# EAGLE schematic Lock (EAGLE 8.4.1)
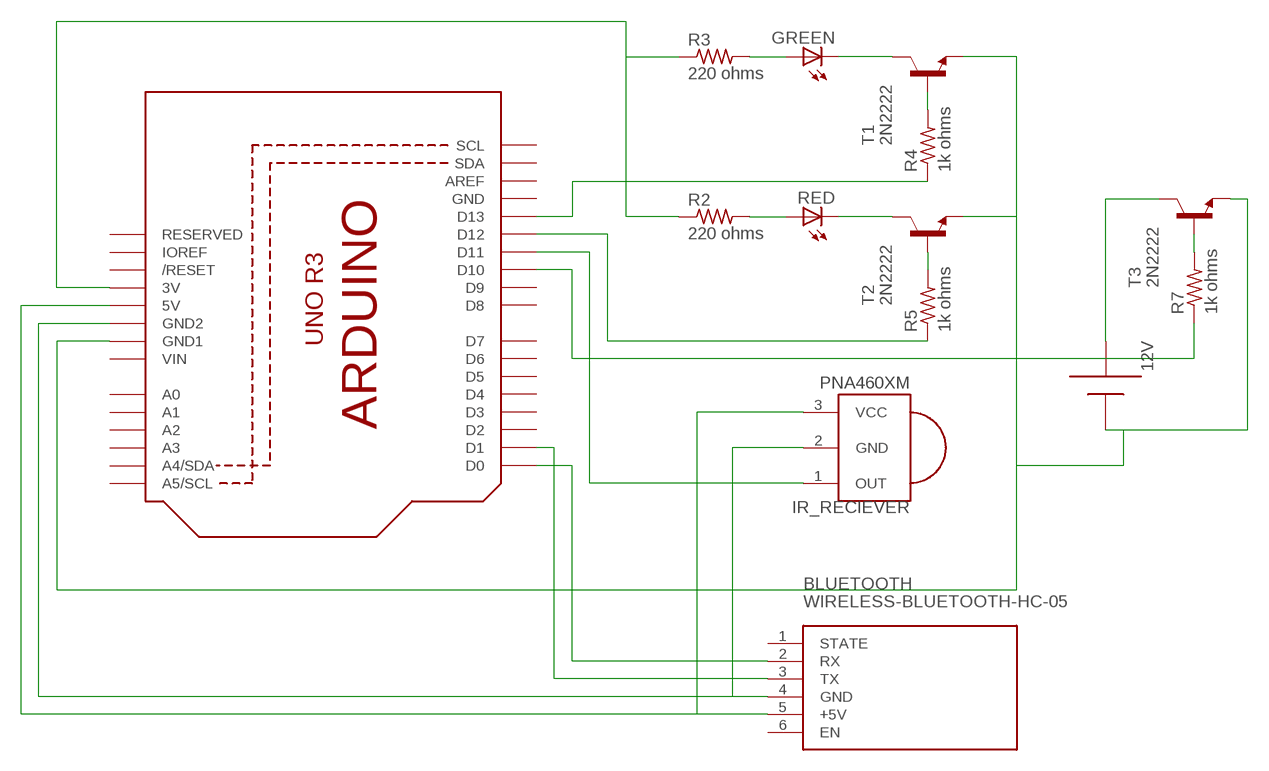
[diagram p0: schematic, sheet 1]

## Parts
12V  AAA  [12BH412]
BLUETOOTH  WIRELESS-BLUETOOTH-HC-05  [WIRELESS-BLUETOOTH-HC-05]
GREEN  LED3MM  [LED3MM]
IR_RECIEVER  PNA460XM  [PNA460XM]
R2  220 ohms  R-US_R1005  [R1005]
R3  220 ohms  R-US_R1005  [R1005]
R4  1k ohms  R-US_R1005  [R1005]
R5  1k ohms  R-US_R1005  [R1005]
R7  1k ohms  R-US_R1005  [R1005]
RED  LED3MM  [LED3MM]
T1  2N2222  [TO92-EBC-OVAL]
T2  2N2222  [TO92-EBC-OVAL]
T3  2N2222  [TO92-EBC-OVAL]
U1  ARDUINOR3-BPLACE  [ARDUINOR3-BPLACE]

## Nets
N$1: R4.2 T1.B
N$2: R5.2 T2.B
N$3: IR_RECIEVER.1(OUT) U1.D11
N$4: BLUETOOTH.5(+5V) IR_RECIEVER.3(VCC) U1.5V
N$5: GREEN.K(C) T1.C
N$6: RED.K(C) T2.C
N$7: R2.2 RED.A
N$8: GREEN.A R3.2
N$9: R2.1 R3.1 U1.3V
N$12: R4.1 U1.D13
N$13: R5.1 U1.D12
N$14: BLUETOOTH.3(TX) U1.D1
N$15: BLUETOOTH.2(RX) U1.D0
N$17: BLUETOOTH.4(GND) IR_RECIEVER.2(GND) U1.GND2
N$18: R7.2 T3.B
N$19: 12V.- T3.C
N$20: 12V.+ T1.E T2.E T3.E U1.GND1
N$21: R7.1 U1.D10
Unconnected: BLUETOOTH.1(STATE) BLUETOOTH.6(EN) U1.A0 U1.A1 U1.A2 U1.A3 U1.A4(A4/SDA) U1.A5(A5/SCL) U1.AREF U1.D2 U1.D3 U1.D4 U1.D5 U1.D6 U1.D7 U1.D8 U1.D9 U1.IOREF U1.RESERVED U1.RESET(/RESET) U1.SCL U1.SDA

## Power pins joined to a net without a drawn wire
GND: U1.GND
VIN: U1.VIN

## Library data of the parts
12V = adafruit:AAA: AAA PC pin holder Mouser part #12BH412 - but pretty much any 1x AAA battery holder should be the same http://www.ladyada.net/library/pcb/eaglelibrary.html
BLUETOOTH = diy-modules:WIRELESS-BLUETOOTH-HC-05: Bluetooth Transceiver Module based on HC-05 board Tutorial is available here: https://arduino-info.wikispaces.com/BlueTooth-HC05-HC06-Modules-How-To Click here to find device on ebay.com <http://www.ebay.com/sch/hc-05+module+rs232>
GREEN RED = adafruit:LED: LED OSRAM: - CHIPLED LG R971, LG N971, LY N971, LG Q971, LY Q971, LO R971, LY R971 LH N974, LH R974 LS Q976, LO Q976, LY Q976 LO Q996 - Hyper CHIPLED LW Q18S LB Q993, LB Q99A, LB R99A - SideLED LS A670, LO A670, LY A670, LG A670, LP A670 LB A673, LV A673, LT A673, LW A673 LH A674 LY A675 LS A676, LA A676, LO A676, LY A676, LW A676 LS A679, LY A679, LG A679 - Hyper Micro SIDELED® LS Y876, LA Y876, LO Y876, LY Y876 LT Y87S - SmartLED LW L88C, LW L88S LB L89C, LB L89S, LG L890 LS L89K, LO L89K, LY L89K LS L896, LA L896, LO L896, LY L896 - TOPLED LS T670, LO T670, LY T670, LG T670, LP T670 LSG T670, LSP T670, LSY T670, LOP T670, LYG T670 LG T671, LOG T671, LSG T671 LB T673, LV T673, LT T673, LW T673 LH T674 LS T676, LA T676, LO T676, LY T676, LB T676, LH T676, LSB T676, LW T676 LB T67C, LV T67C, LT T67C, LS T67K, LO T67K, LY T67K, LW E67C LS E67B, LA E67B, LO E67B, LY E67B, LB E67C, LV E67C, LT E67C LW T67C LS T679, LY T679, LG T679 LS T770, LO T770, LY T770, LG T770, LP T770 LB T773, LV T773, LT T773, LW T773 LH T774 LS E675, LA E675, LY E675, LS T675 LS T776, LA T776, LO T776, LY T776, LB T776 LHGB T686 LT T68C, LB T68C - Hyper Mini TOPLED® LB M676 - Mini TOPLED Santana® LG M470 LS M47K, LO M47K, LY M47K Source: http://www.osram.convergy.de/
IR_RECIEVER = adafruit:PNA460XM: IR 38KHz receiver PNA4602 and related receivers http://www.ladyada.net/library/pcb/eaglelibrary.html
R2-R4 R7 = adafruit:R-US_: RESISTOR, American symbol
R5 = adafruit:R-US_: RESISTOR, American symbol; R5: 1k
T1-T3 = adafruit:2N2222: NPN TRANSISTOR Big oval pads
U1 = adafruit:ARDUINOR3: This is a new object for the new Arduino R3 - with extra pins that you may want to use (such as IOref, and duplicated A4/A5